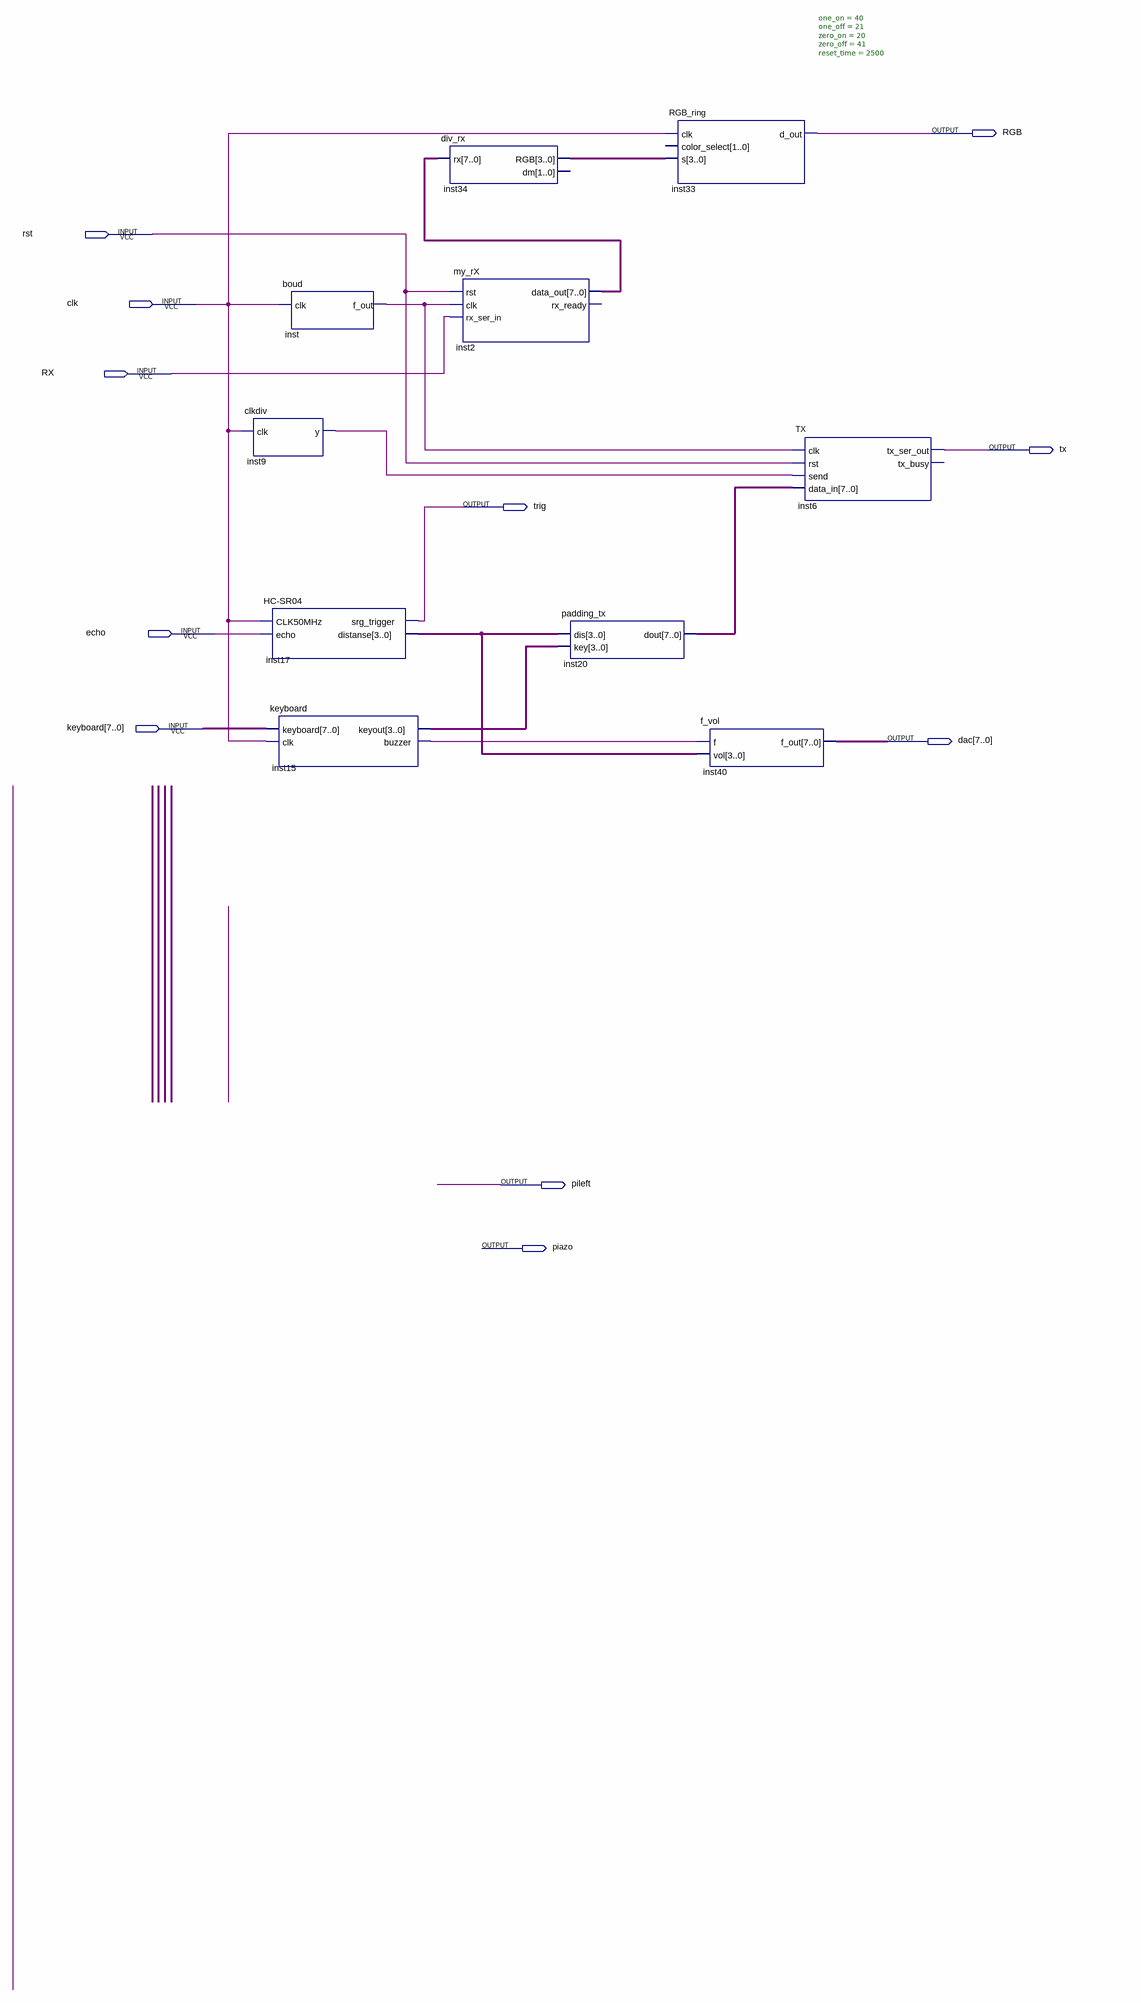
[diagram p0: schematic sheet]
// Quartus schematic BlockT.bdf as structural Verilog: 10 symbols, 11 pins
module BlockT (
  input  rst,
  input  clk,
  input  RX,
  input  echo,
  input  [7:0] keyboard,
  output RGB,
  output tx,
  output trig,
  output [7:0] dac,
  output pileft,
  output piazo
);

  wire inst9_y, inst15_buzzer, inst_f_out;
  wire [3:0] inst15_keyout, inst17_distanse, inst34_rgb;
  wire [7:0] inst2_data_out, inst20_dout;

  clkdiv inst9 (.clk(clk), .y(inst9_y));
  boud inst (.clk(clk), .f_out(inst_f_out));
  \HC-SR04  inst17 (.CLK50MHz(clk), .echo(echo), .srg_trigger(trig), .distanse(inst17_distanse));
  keyboard inst15 (.keyboard(keyboard), .clk(clk), .keyout(inst15_keyout), .buzzer(inst15_buzzer));
  div_rx inst34 (.rx(inst2_data_out), .RGB(inst34_rgb));  // open: dm
  my_rX inst2 (.rst(rst), .clk(inst_f_out), .rx_ser_in(RX), .data_out(inst2_data_out));  // open: rx_ready
  padding_tx inst20 (.dis(inst17_distanse), .key(inst15_keyout), .dout(inst20_dout));
  RGB_ring #(.one_on(40), .one_off(21), .zero_on(20), .zero_off(41), .reset_time(2500)) inst33 (
    .clk(clk), .s(inst34_rgb), .d_out(RGB));  // open: color_select
  f_vol inst40 (.f(inst15_buzzer), .vol(inst17_distanse), .f_out(dac));
  TX inst6 (.clk(inst_f_out), .rst(rst), .send(inst9_y), .data_in(inst20_dout), .tx_ser_out(tx));  // open: tx_busy
endmodule
